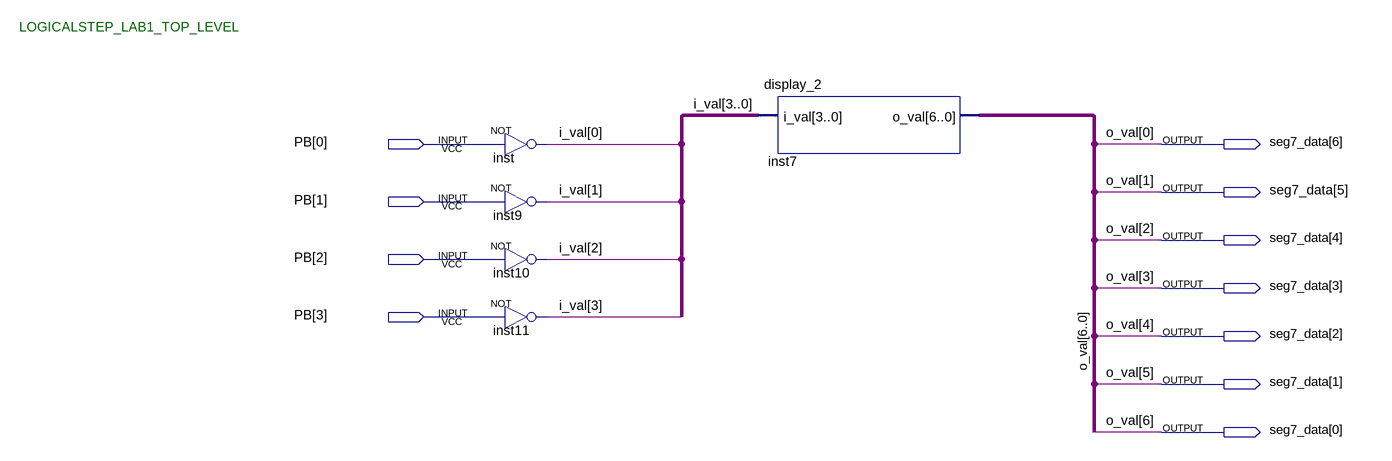
[diagram p0: schematic sheet]
// Quartus schematic main.bdf as structural Verilog: 5 symbols, 11 pins
module main (
  input  [3:0] PB,
  output [6:0] seg7_data
);

  wire [3:0] i_val;

  not inst (i_val[0], PB[0]);
  not inst9 (i_val[1], PB[1]);
  not inst10 (i_val[2], PB[2]);
  not inst11 (i_val[3], PB[3]);
  display_2 inst7 (
    .i_val(i_val),
    .o_val({seg7_data[0], seg7_data[1], seg7_data[2], seg7_data[3], seg7_data[4], seg7_data[5], seg7_data[6]}));

  // Other names for the same wires on the sheet: o_val[6:0] = {seg7_data[0], seg7_data[1], seg7_data[2], seg7_data[3], seg7_data[4], seg7_data[5], seg7_data[6]}

  // Notes on the sheet:
  //   LOGICALSTEP_LAB1_TOP_LEVEL
endmodule
